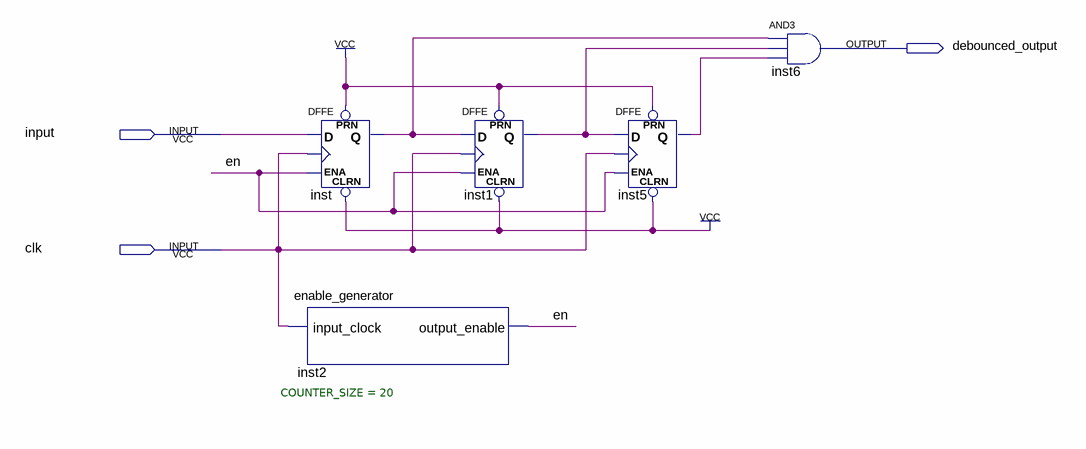
[diagram p0: schematic sheet]
// Quartus schematic debouncer.bdf as structural Verilog: 5 symbols, 3 pins
module debouncer (
  input  \input ,
  input  clk,
  output debounced_output
);

  wire en, inst1_q, inst5_q, inst_q;

  enable_generator #(.COUNTER_SIZE(20)) inst2 (.input_clock(clk), .output_enable(en));
  DFFE inst (.PRN(1'b1), .CLRN(1'b1), .D(\input ), .CLK(clk), .ENA(en), .Q(inst_q));
  DFFE inst1 (.PRN(1'b1), .CLRN(1'b1), .D(inst_q), .CLK(clk), .ENA(en), .Q(inst1_q));
  DFFE inst5 (.PRN(1'b1), .CLRN(1'b1), .D(inst1_q), .CLK(clk), .ENA(en), .Q(inst5_q));
  and inst6 (debounced_output, inst_q, inst1_q, inst5_q);
endmodule
